# Altium schematic sheet [1]_InterfaceConnectors.SchDoc: Interface connectors, mounting holes & testpads
size A4; DocumentNumber: 1; SheetNumber: 1; SheetTotal: 8
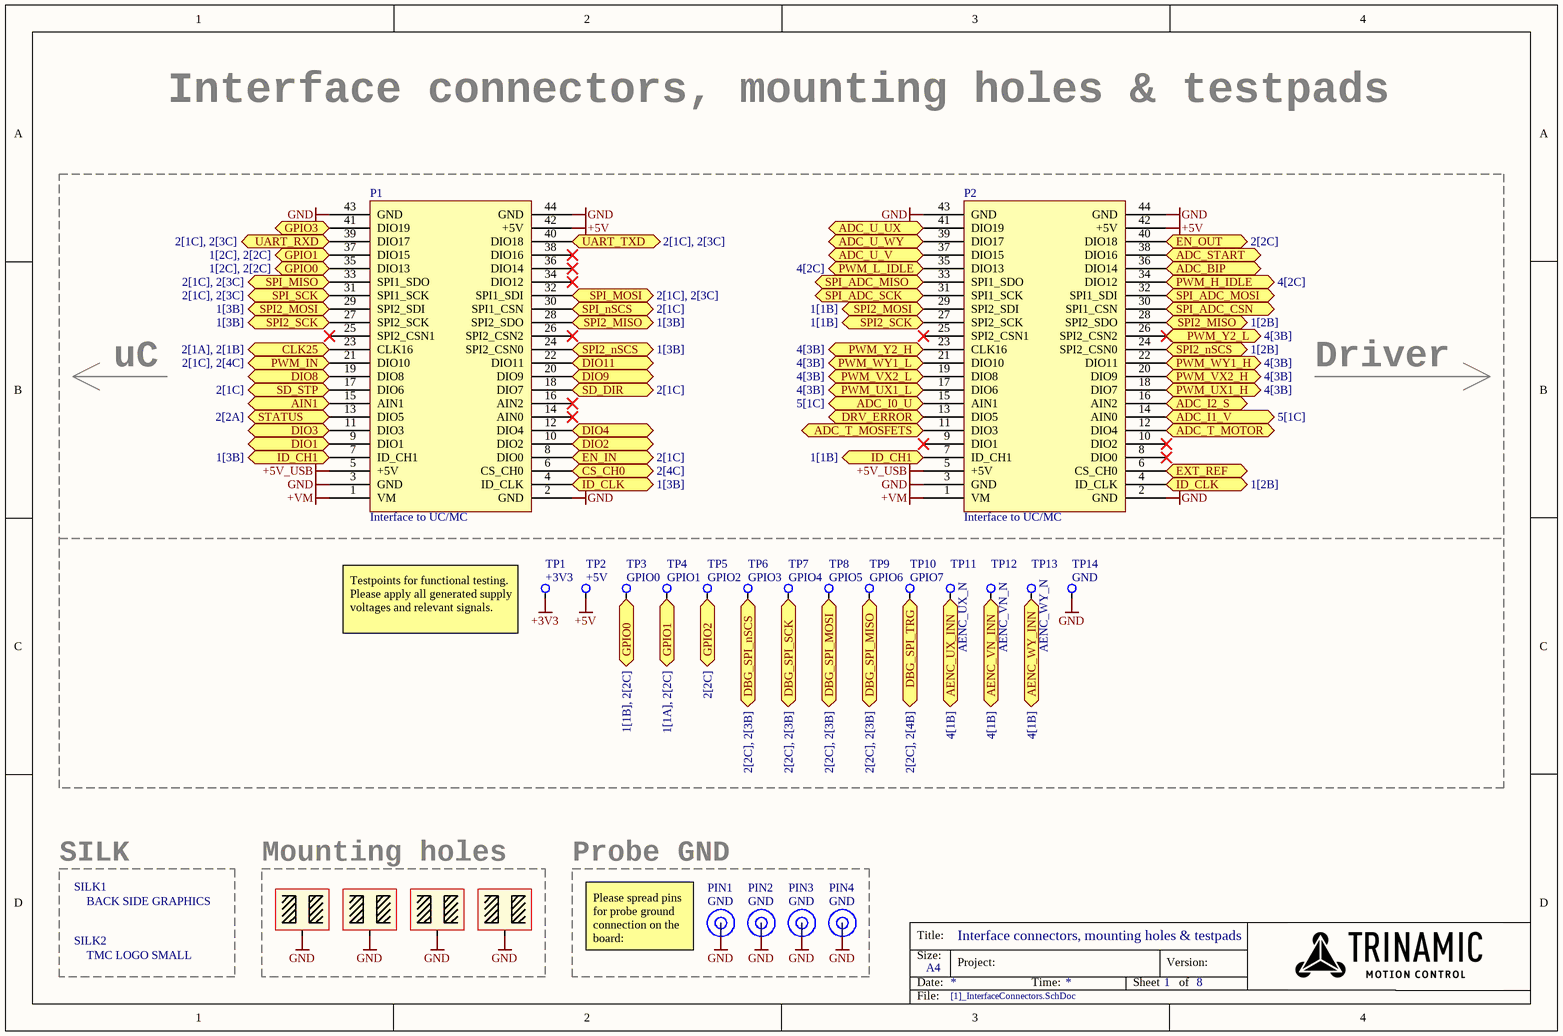
[diagram p0: [1]_InterfaceConnectors.SchDoc]

## Parts
MNT1  MOUNTING_HOLE  [MNT_HOLE_6.35-3.2]  (value not drawn)  (no BOM)
MNT2  MOUNTING_HOLE  [MNT_HOLE_6.35-3.2]  (value not drawn)  (no BOM)
MNT3  MOUNTING_HOLE  [MNT_HOLE_6.35-3.2]  (value not drawn)  (no BOM)
MNT4  MOUNTING_HOLE  [MNT_HOLE_6.35-3.2]  (value not drawn)  (no BOM)
P1  Interface to UC/MC  [Interface_Connector]
P2  Interface to UC/MC  [Interface_Connector]
PIN1  GND  [TP_1.1-1.85_OCT]  (no BOM)
PIN2  GND  [TP_1.1-1.85_OCT]  (no BOM)
PIN3  GND  [TP_1.1-1.85_OCT]  (no BOM)
PIN4  GND  [TP_1.1-1.85_OCT]  (no BOM)
SILK1  BACK SIDE GRAPHICS  [TMC4671_EVAL_v1_0_back_label]  (no BOM)
SILK2  TMC LOGO SMALL  [TMC_logo_small]  (no BOM)
TP1  +3V3  [TP_SMD_1.2MM_ROUND]  (no BOM)
TP2  +5V  [TP_SMD_1.2MM_ROUND]  (no BOM)
TP3  GPIO0  [TP_SMD_1.2MM_ROUND]  (no BOM)
TP4  GPIO1  [TP_SMD_1.2MM_ROUND]  (no BOM)
TP5  GPIO2  [TP_SMD_1.2MM_ROUND]  (no BOM)
TP6  GPIO3  [TP_SMD_1.2MM_ROUND]  (no BOM)
TP7  GPIO4  [TP_SMD_1.2MM_ROUND]  (no BOM)
TP8  GPIO5  [TP_SMD_1.2MM_ROUND]  (no BOM)
TP9  GPIO6  [TP_SMD_1.2MM_ROUND]  (no BOM)
TP10  GPIO7  [TP_SMD_1.2MM_ROUND]  (no BOM)
TP11  AENC_UX_N  [TP_SMD_1.2MM_ROUND]  (no BOM)
TP12  AENC_VN_N  [TP_SMD_1.2MM_ROUND]  (no BOM)
TP13  AENC_WY_N  [TP_SMD_1.2MM_ROUND]  (no BOM)
TP14  GND  [TP_SMD_1.2MM_ROUND]  (no BOM)

## Blocks framed on the sheet
SILK: SILK1 SILK2
Mounting holes: MNT1-MNT4
Probe GND: PIN1-PIN4

## Ports
ADC_BIP, ADC_I0_U (see 5[1C]), ADC_I1_V (see 5[1C]), ADC_I2_S, ADC_START, ADC_T_MOSFETS, ADC_T_MOTOR, ADC_U_UX, ADC_U_V, ADC_U_WY, AENC_UX_INN (see 4[1B]), AENC_VN_INN (see 4[1B]), AENC_WY_INN (see 4[1B]), AIN1, CLK25 (see 2[1A], 2[1B]), CS_CH0 (see 2[4C]), DBG_SPI_MISO (see 2[2C], 2[3B]), DBG_SPI_MOSI (see 2[2C], 2[3B]), DBG_SPI_nSCS (see 2[2C], 2[3B]), DBG_SPI_SCK (see 2[2C], 2[3B]), DBG_SPI_TRG (see 2[2C], 2[4B]), DIO1, DIO2, DIO3, DIO4, DIO8, DIO9, DIO11, DRV_ERROR, EN_IN (see 2[1C]), EN_OUT (see 2[2C]), EXT_REF, GPIO0 (see 1[1B], 2[2C]), GPIO0 (see 1[2C], 2[2C]), GPIO1 (see 1[1A], 2[2C]), GPIO1 (see 1[2C], 2[2C]), GPIO2 (see 2[2C]), GPIO3, ID_CH1 (see 1[1B]), ID_CH1 (see 1[3B]), ID_CLK (see 1[2B]), ID_CLK (see 1[3B]), PWM_H_IDLE (see 4[2C]), PWM_IN (see 2[1C], 2[4C]), PWM_L_IDLE (see 4[2C]), PWM_UX1_H (see 4[3B]), PWM_UX1_L (see 4[3B]), PWM_VX2_H (see 4[3B]), PWM_VX2_L (see 4[3B]), PWM_WY1_H (see 4[3B]), PWM_WY1_L (see 4[3B]), PWM_Y2_H (see 4[3B]), PWM_Y2_L (see 4[3B]), SD_DIR (see 2[1C]), SD_STP (see 2[1C]), SPI2_MISO (see 1[2B]), SPI2_MISO (see 1[3B]), SPI2_MOSI (see 1[1B]), SPI2_MOSI (see 1[3B]), SPI2_nSCS (see 1[2B]), SPI2_nSCS (see 1[3B]), SPI2_SCK (see 1[1B]), SPI2_SCK (see 1[3B]), SPI_ADC_CSN, SPI_ADC_MISO, SPI_ADC_MOSI, SPI_ADC_SCK, SPI_MISO (see 2[1C], 2[3C]), SPI_MOSI (see 2[1C], 2[3C]), SPI_nSCS (see 2[1C]), SPI_SCK (see 2[1C], 2[3C]), STATUS (see 2[2A]), UART_RXD (see 2[1C], 2[3C]), UART_TXD (see 2[1C], 2[3C])

## Nets
+3V3: TP1.1
+5V: P1.42(+5V) P2.42(+5V) TP2.1
+5V_USB: P1.5(+5V) P2.5(+5V)
+VM: P1.1(VM) P2.1(VM)
GND: MNT1.1 MNT2.1 MNT3.1 MNT4.1 P1.2(GND) P1.3(GND) P1.43(GND) P1.44(GND) P2.2(GND) P2.3(GND) P2.43(GND) P2.44(GND) PIN1.1 PIN2.1 PIN3.1 PIN4.1 TP14.1
ADC_BIP: P2.36(DIO14) ; port ADC_BIP
ADC_I0_U: P2.15(AIN1) ; port ADC_I0_U
ADC_I1_V: P2.14(AIN0) ; port ADC_I1_V
ADC_I2_S: P2.16(AIN2) ; port ADC_I2_S
ADC_START: P2.38(DIO16) ; port ADC_START
ADC_T_MOSFETS: P2.11(DIO3) ; port ADC_T_MOSFETS
ADC_T_MOTOR: P2.12(DIO4) ; port ADC_T_MOTOR
ADC_U_UX: P2.41(DIO19) ; port ADC_U_UX
ADC_U_V: P2.37(DIO15) ; port ADC_U_V
ADC_U_WY: P2.39(DIO17) ; port ADC_U_WY
AENC_UX_INN: TP11.1 ; port AENC_UX_INN
AENC_VN_INN: TP12.1 ; port AENC_VN_INN
AENC_WY_INN: TP13.1 ; port AENC_WY_INN
AIN1: P1.15(AIN1) ; port AIN1
CLK25: P1.23(CLK16) ; port CLK25
CS_CH0: P1.6(CS_CH0) ; port CS_CH0
DBG_SPI_MISO: TP9.1 ; port DBG_SPI_MISO
DBG_SPI_MOSI: TP8.1 ; port DBG_SPI_MOSI
DBG_SPI_nSCS: TP6.1 ; port DBG_SPI_nSCS
DBG_SPI_SCK: TP7.1 ; port DBG_SPI_SCK
DBG_SPI_TRG: TP10.1 ; port DBG_SPI_TRG
DIO1: P1.9(DIO1) ; port DIO1
DIO2: P1.10(DIO2) ; port DIO2
DIO3: P1.11(DIO3) ; port DIO3
DIO4: P1.12(DIO4) ; port DIO4
DIO8: P1.19(DIO8) ; port DIO8
DIO9: P1.20(DIO9) ; port DIO9
DIO11: P1.22(DIO11) ; port DIO11
DRV_ERROR: P2.13(DIO5) ; port DRV_ERROR
EN_IN: P1.8(DIO0) ; port EN_IN
EN_OUT: P2.40(DIO18) ; port EN_OUT
EXT_REF: P2.6(CS_CH0) ; port EXT_REF
GPIO0: P1.35(DIO13) TP3.1 ; port GPIO0
GPIO1: P1.37(DIO15) TP4.1 ; port GPIO1
GPIO2: TP5.1 ; port GPIO2
GPIO3: P1.41(DIO19) ; port GPIO3
ID_CH1: P1.7(ID_CH1) P2.7(ID_CH1) ; port ID_CH1
ID_CLK: P1.4(ID_CLK) P2.4(ID_CLK) ; port ID_CLK
PWM_H_IDLE: P2.34(DIO12) ; port PWM_H_IDLE
PWM_IN: P1.21(DIO10) ; port PWM_IN
PWM_L_IDLE: P2.35(DIO13) ; port PWM_L_IDLE
PWM_UX1_H: P2.18(DIO7) ; port PWM_UX1_H
PWM_UX1_L: P2.17(DIO6) ; port PWM_UX1_L
PWM_VX2_H: P2.20(DIO9) ; port PWM_VX2_H
PWM_VX2_L: P2.19(DIO8) ; port PWM_VX2_L
PWM_WY1_H: P2.22(DIO11) ; port PWM_WY1_H
PWM_WY1_L: P2.21(DIO10) ; port PWM_WY1_L
PWM_Y2_H: P2.23(CLK16) ; port PWM_Y2_H
PWM_Y2_L: P2.26(SPI2_CSN2) ; port PWM_Y2_L
SD_DIR: P1.18(DIO7) ; port SD_DIR
SD_STP: P1.17(DIO6) ; port SD_STP
SPI2_MISO: P1.28(SPI2_SDO) P2.28(SPI2_SDO) ; port SPI2_MISO
SPI2_MOSI: P1.29(SPI2_SDI) P2.29(SPI2_SDI) ; port SPI2_MOSI
SPI2_nSCS: P1.24(SPI2_CSN0) P2.24(SPI2_CSN0) ; port SPI2_nSCS
SPI2_SCK: P1.27(SPI2_SCK) P2.27(SPI2_SCK) ; port SPI2_SCK
SPI_ADC_CSN: P2.30(SPI1_CSN) ; port SPI_ADC_CSN
SPI_ADC_MISO: P2.33(SPI1_SDO) ; port SPI_ADC_MISO
SPI_ADC_MOSI: P2.32(SPI1_SDI) ; port SPI_ADC_MOSI
SPI_ADC_SCK: P2.31(SPI1_SCK) ; port SPI_ADC_SCK
SPI_MISO: P1.33(SPI1_SDO) ; port SPI_MISO
SPI_MOSI: P1.32(SPI1_SDI) ; port SPI_MOSI
SPI_nSCS: P1.30(SPI1_CSN) ; port SPI_nSCS
SPI_SCK: P1.31(SPI1_SCK) ; port SPI_SCK
STATUS: P1.13(DIO5) ; port STATUS
UART_RXD: P1.39(DIO17) ; port UART_RXD
UART_TXD: P1.40(DIO18) ; port UART_TXD

Not connected (* = marked no-connect by the designer): P1 14(AIN0)* 16(AIN2)* 25(SPI2_CSN1)* 26(SPI2_CSN2)* 34(DIO12)* 36(DIO14)* 38(DIO16)*; P2 8(DIO0)* 9(DIO1)* 10(DIO2)* 25(SPI2_CSN1)*

## Notes on the sheet
- uC
- Driver
- (near TP1) Testpoints for functional testing.
  Please apply all generated supply voltages and relevant signals.
- (near PIN1) Please spread pins for probe ground connection on the board:
- Title:
- Size:
- Date:
- A4
- Project:
- Time:
- Sheet
- Version:
- of
- File:

## Library data of the parts
P1 P2 = Interface Connector, 44 Pins: Board-To-Board Connector, 2.54 mm, 44 Contacts, Receptacle, HLE Series, Surface Mount, 2 Rows; MPN: HLE-122-02-L-DV; MF: SAMTEC
PIN1-PIN4 = TP_1.1-1.85_OCT: TH testpoint, 1.1 hole, 1.85 pad, octagonal
SILK1 SILK2 = SILK_GFX
TP1-TP14 = TP_SMD_Xmm: SMD testpoint, 1.2mm pad, round